# Altium schematic sheet Concept.SchDoc: MPPT Controller
size 840 x 594 mm; Date: 16/02/2020; Author: Tikhonov; DrawnBy: Tikhonov; Engineer: Tikhonov; DocumentNumber: -; Revision: A; SheetNumber: 1; SheetTotal: 1; DocumentType: Block schematic; Liter: {Liter}; PageSetup: Record=PageOptions|CenterHorizontal=True|CenterVertical=True|PrintScale=0.68|XCorrection=1.00|YCorrection=1.00|PrintKind=1|BorderSize=5000000|LeftOffset=0|BottomOffset=0|Orientation=2|PaperLength=1000|PaperWidth=1000|Scale=100|PaperSource=7|PrintQuality=-4|MediaType=1|DitherType=10|PaperKind=A3 (297 x 420 мм)|PrintScaleMode=1; DocumentStatus: Released; DecimalNumber: -; Language: en; ResponsibleDept: -; DocumentFullPathAndName: -; DocumentName: -
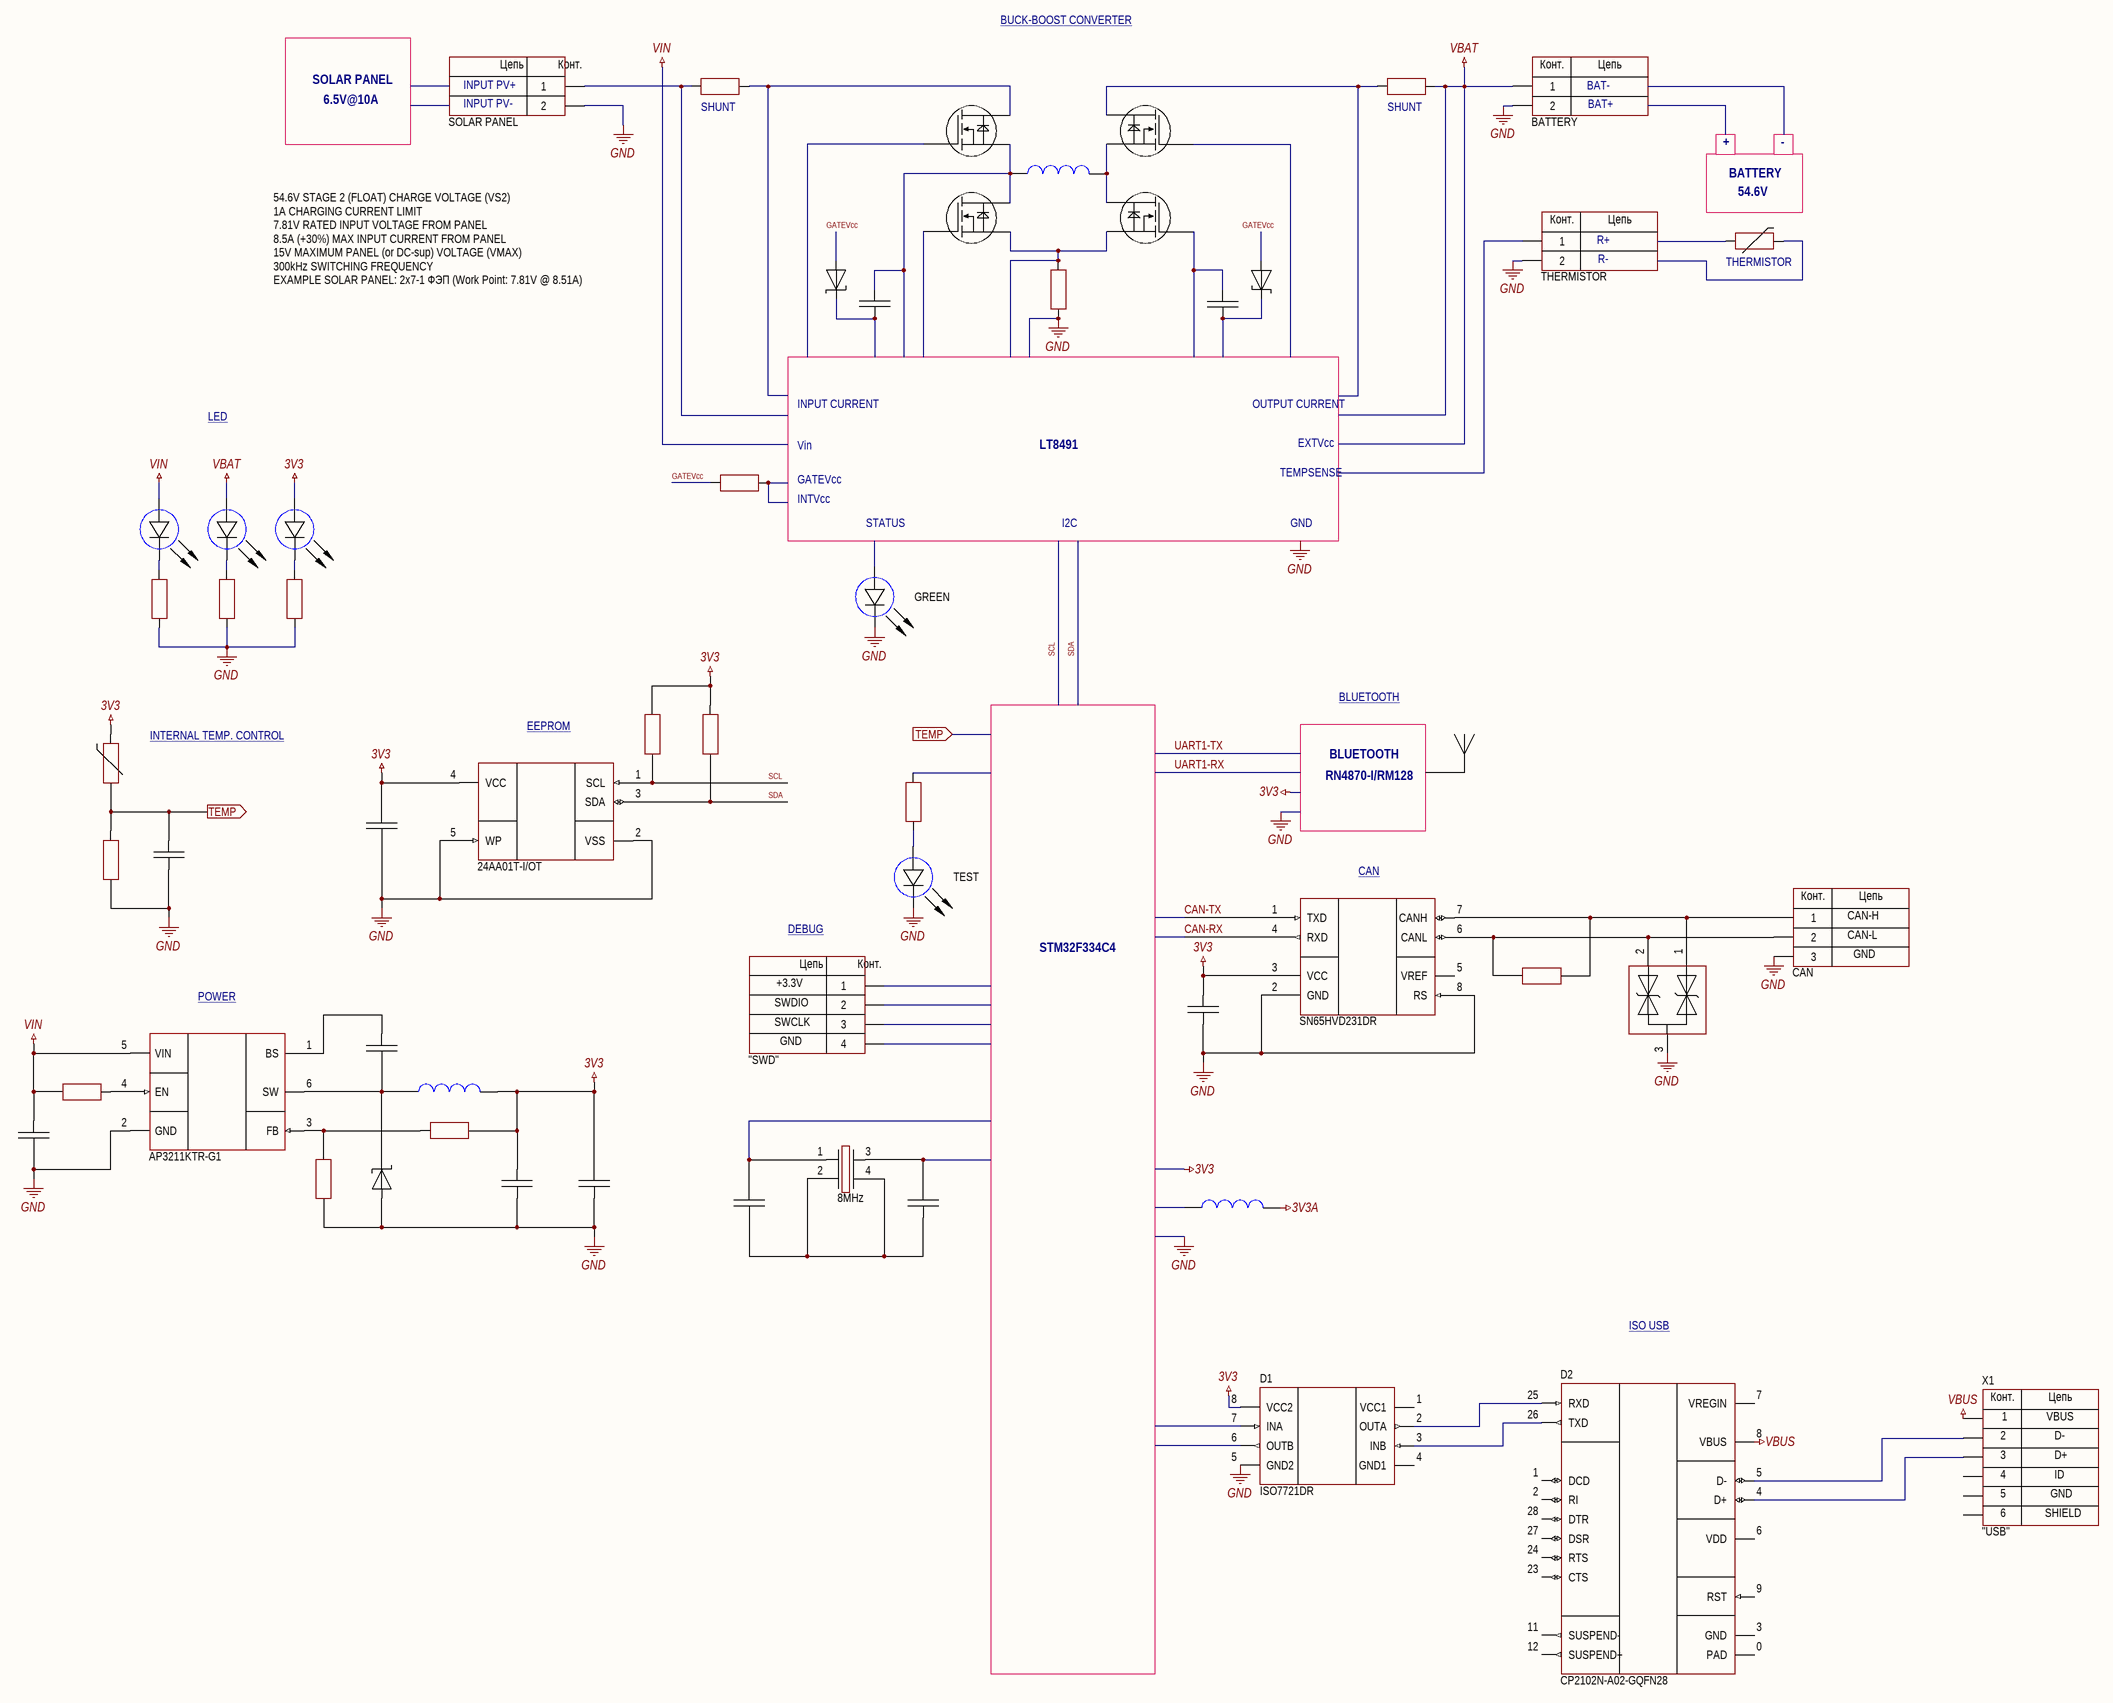
[diagram p0: Concept.SchDoc]

## Parts
(Parts that share a designator on the sheet are numbered #1, #2 ... from top to bottom, then left to right.)
C18  (no value)  [CAP: 0805]
C20  (no value)  [CAP: 0805]
C21  (no value)  [CAP: 0805]
C22  (no value)  [CAP: 0805]
C39  (no value)  [CAP: 0805]
C40  (no value)  [CAP: 0805]
C41  (no value)  [CAP: 0805]
C42  (no value)  [CAP: 0805]
C43  (no value)  [CAP: 0805]
C?#1  (no value)  [CAP: 0603]
C?#2  (no value)  [CAP: 0603]
D1  (no value)  [8-SOIC]
D2  PartNumber: CP2102N-A02-GQFN28  [28-QFN (5x5)]
D4  (no value)  [SOT23-6]
D8  PartNumber: 24AA01T-I/OT  [SOT23-5]
D9  (no value)  [8-SOIC]
L2  (no value)  [IND: SDR0403]
L?#1  (no value)  [IND: 0603]
L?#2  (no value)  [IND: 0603]
R32  (no value)  [RES: 0805]
R33  (no value)  [RES: 0805]
R36  (no value)  [RES: 0805]
R43  (no value)  [RES: 0805]
R44  (no value)  [RES: 0805]
R45  (no value)  [RES: 0805]
R48  (no value)  [RES: 0805]
R49  (no value)  [RES: 0805]
R?#1  (no value)  [RES: 0603]
R?#2  (no value)  [RES: 0603]
R?#3  TypeResistor: THERMISTOR  [RES: 0805]
R?#4  (no value)  [RES: 0603]
R?#5  (no value)  [RES: 0603]
R?#6  (no value)  [RES: 0603]
R?#7  (no value)  [RES: 0603]
R?#8  (no value)  [RES: 0603]
R?#9  (no value)  [RES: 0603]
VD3  (no value)  [DIODE: SOD123F]
VD5  (no value)  [SOT23]
VD?#1  (no value)  [DIODE: SMA]
VD?#2  (no value)  [DIODE: SMA]
VD?#3  (no value)  [LED: 0402B]
VD?#4  (no value)  [LED: 0402B]
VD?#5  (no value)  [LED: 0402B]
VD?#6  Color: GREEN  [LED: 0402B]
VD?#7  Color: TEST  [LED: 0402B]
VT?#1  MOSFET_N  (value not drawn)
VT?#2  MOSFET_N  (value not drawn)
VT?#3  MOSFET_N  (value not drawn)
VT?#4  MOSFET_N  (value not drawn)
X1  CommentText: "USB"  [CON: USB micro-A (ZX62-B-5PA)]
X2#1  CommentText: SOLAR PANEL  1: INPUT PV+  2: INPUT PV-  [CON: XT60PW-M]
X2#2  CommentText: BATTERY  1: BAT-  2: BAT+  [CON: XT60PW-M]
X2#3  CommentText: THERMISTOR  1: R+  2: R-  [CON: XT60PW-M]
X4  CommentText: "SWD"  [CON: SM04B-GHS]
X?  CommentText: CAN  [CON: 6PCV-03-006]
Z1  Frequency: 8MHz  [OSC: 3225]

## Ports
TEMP (in), TEMP (out)

## Nets
3V3: C21.2 C22.2 C41.2 C42.2 D1.8(VCC2) D8.4(VCC) D9.3(VCC) L2.1 R33.1 R43.2 R44.2 R48.2 VD?#5.1(A)
3V3A: L?#2.1
GND: C20.1 C21.1 C22.1 C41.1 C42.1 C43.1 D1.5(GND2) D4.2(GND) D8.2(VSS) D8.5(WP) D9.2(GND) D9.8(RS) R36.1 R49.1 R?#4.1 R?#6.1 R?#7.1 R?#8.1 VD3.1 VD5.3 VD?#6.2(C) VD?#7.2(C) X2#1.2 X2#2.2 X2#3.2 X?.3
VBAT: R?#2.1 VD?#4.1(A) X2#2.1
VBUS: D2.8(VBUS) X1.1
VIN: C20.2 D4.5(VIN) R32.2 VD?#3.1(A)
CAN-RX: D9.4(RXD)
CAN-TX: D9.1(TXD)
GATEVcc: R?#5.2
SCL: D8.1(SCL) R43.1
SDA: D8.3(SDA) R44.1
TEMP: C43.2 R48.1 R49.2 ; port TEMP
NetC18_1: C18.1 D4.6(SW) L2.2 VD3.2
NetC18_2: C18.2 D4.1(BS)
NetC39_1: C39.1 C40.1 Z1.2 Z1.4
NetC39_2: C39.2 Z1.1
NetC40_2: C40.2 Z1.3
NetC?#1_1: C?#1.1 VD?#1.2
NetC?#1_2: C?#1.2 L?#1.2 VT?#1.S VT?#3.D
NetC?#2_1: C?#2.1 VD?#2.2
NetC?#2_2: C?#2.2 VT?#4.G
NetD1_2: D1.2(OUTA) D2.25(RXD)
NetD1_3: D1.3(INB) D2.26(TXD)
NetD2_4: D2.4(D+) X1.3
NetD2_5: D2.5(D-) X1.2
NetD4_3: D4.3(FB) R33.2 R36.2
NetD4_4: D4.4(EN) R32.1
NetD9_6: D9.6(CANL) R45.2 VD5.2 X?.2
NetD9_7: D9.7(CANH) R45.1 VD5.1 X?.1
NetL?#1_1: L?#1.1 VT?#2.S VT?#4.D
NetR?#1_1: R?#1.1 VT?#1.D
NetR?#1_2: R?#1.2 X2#1.1
NetR?#2_2: R?#2.2 VT?#2.D
NetR?#4_2: R?#4.2 VT?#3.S VT?#4.S
NetR?#6_2: R?#6.2 VD?#3.2(C)
NetR?#7_2: R?#7.2 VD?#4.2(C)
NetR?#8_2: R?#8.2 VD?#5.2(C)
NetR?#9_1: R?#9.1 VD?#7.1(A)

Not connected (* = marked no-connect by the designer): D1 1(VCC1) 4(GND1) 6(OUTB) 7(INA); D2 0(PAD) 1(DCD) 2(RI) 3(GND) 6(VDD) 7(VREGIN) 9(RST) 11(SUSPEND-) 12(SUSPEND+) 23(CTS) 24(RTS) 27(DSR) 28(DTR); D9 5(VREF); L?#2 2; R?#3 1 2; R?#5 1; R?#9 2; VD?#1 1; VD?#2 1; VD?#6 1(A); VT?#1 G; VT?#2 G; VT?#3 G; X1 0 4 5; X2#3 1; X4 1 2 3 4

## Notes on the sheet
- BUCK-BOOST CONVERTER
- SOLAR PANEL
- 6.5V@10A
- (near R?#1) SHUNT
- (near R?#2) SHUNT
- +
- -
- BATTERY
- 54.6V
- 54.6V STAGE 2 (FLOAT) CHARGE VOLTAGE (VS2)
  1A CHARGING CURRENT LIMIT
  7.81V RATED INPUT VOLTAGE FROM PANEL
  8.5A (+30%) MAX INPUT CURRENT FROM PANEL
  15V MAXIMUM PANEL (or DC-sup) VOLTAGE (VMAX)
  300kHz SWITCHING FREQUENCY
  EXAMPLE SOLAR PANEL: 2x7-1 ФЭП (Work Point: 7.81V @ 8.51A)
- INPUT CURRENT
- OUTPUT CURRENT
- LED
- Vin
- LT8491
- EXTVcc
- (near R?#5) GATEVcc
- INTVcc
- TEMPSENSE
- STATUS
- I2C
- GND
- BLUETOOTH
- (near R48) INTERNAL TEMP. CONTROL
- EEPROM
- RN4870-I/RM128
- (near D9) CAN
- DEBUG
- STM32F334C4
- CAN-H
- CAN-L
- POWER
- SWDIO
- +3.3V
- SWCLK
- ISO USB
- Labels drawn without touching a wire or pin: GATEVcc, GND
- 1
- 2
- 3
- 4
- 5
- 6
- 7
- 8
- 9
- 10
- 11
- 12
- 13
- 14
- 15
- 16
- A
- B
- C
- D
- E
- F
- G
- H
- K
- L
- M
- Responsible dept.
- Technical reference
- Document type
- Document status
- N
- Legal owner
- Created by
- Title, Supplementary title
- Approved by
- Rev.
- Date of issue
- Lang.
- Sheet
- /
- A1
- (in symbol Connector_6PCV-03) Конт.; Цепь
- (in symbol Connector_SM04B) Цепь; Конт.
- (in symbol Connector_USB_micro_B) Конт.; Цепь; VBUS; D-; D+; ID; GND; 6; SHIELD
- (in symbol Connector_XT_2pin) Цепь; Конт.

## Library data of the parts
C18 C43 = Ceramic_0805: Manufacturer: Samsung; PartNumber: CL21B103KBANNNC; TypeCapacitor: Ceramic capacitor; TypeDielectric: X7R; Package: 0805; HelpURL: https://www.digikey.com/product-detail/en/samsung-electro-mechanics/CL21B103KBANNNC/1276-1015-1-ND/3889101; ValueManufacturerPartNumber: =TypeCapacitor+', '+Value+', '+TypeDielectric+', '+Tolerance+', '+Voltage+', '+Package+', '+Temperature; Temperature: -55...+125°C
C20 = Ceramic_0805: Manufacturer: Samsung; PartNumber: CL21B225KAFNFNE; TypeCapacitor: Ceramic capacitor; TypeDielectric: X7R; Package: 0805; HelpURL: https://www.digikey.com/product-detail/en/samsung-electro-mechanics/CL21B225KAFNFNE/1276-2953-1-ND/3891039; ValueManufacturerPartNumber: =TypeCapacitor+', '+Value+', '+TypeDielectric+', '+Tolerance+', '+Voltage+', '+Package+', '+Temperature; Temperature: -55...+125°C
C21 C22 = Ceramic_0805: Manufacturer: Samsung; PartNumber: CL21B106KQQNNNG; TypeCapacitor: Ceramic capacitor; TypeDielectric: X7R; Package: 0805; HelpURL: https://www.digikey.com/product-detail/en/samsung-electro-mechanics/CL21B106KQQNNNG/1276-6474-1-ND/5958102; ValueManufacturerPartNumber: =TypeCapacitor+', '+Value+', '+TypeDielectric+', '+Tolerance+', '+Voltage+', '+Package+', '+Temperature; Temperature: -55...+125°C
C39 C40 = Ceramic_0805: Manufacturer: Samsung; PartNumber: CL21C120JBANNNC; TypeCapacitor: Ceramic capacitor; TypeDielectric: NPO; Package: 0805; HelpURL: https://www.digikey.com/product-detail/en/samsung-electro-mechanics/CL21C120JBANNNC/1276-1120-1-ND/3889206; ValueManufacturerPartNumber: =TypeCapacitor+', '+Value+', '+TypeDielectric+', '+Tolerance+', '+Voltage+', '+Package+', '+Temperature; Temperature: -55...+125°C
C41 C42 = Ceramic_0805: Manufacturer: Samsung; PartNumber: CL21B104KBCNFNC; TypeCapacitor: Ceramic capacitor; TypeDielectric: X7R; Package: 0805; HelpURL: https://www.digikey.com/product-detail/en/samsung-electro-mechanics/CL21B104KBCNFNC/1276-2444-1-ND/3890530; ValueManufacturerPartNumber: =TypeCapacitor+', '+Value+', '+TypeDielectric+', '+Tolerance+', '+Voltage+', '+Package+', '+Temperature; Temperature: -55...+125°C
C?#1 C?#2 = Ceramic_0603: Manufacturer: Yageo; PartNumber: CC0603KRX7R7BB104; ValueManufacturerPartNumber: Ceramic capacitor, 0.1?F, X7R, ±10%, 16V, 0603, -55...+125°C; TypeCapacitor: Ceramic capacitor; Tolerance: ±10%; TypeDielectric: X7R; Voltage: 16V; Value: 0.1?F; Package: 0603; HelpURL: https://www.digikey.com/product-detail/en/yageo/CC0603KRX7R7BB104/311-1088-1-ND/302998; Temperature: -55...+125°C
D1 = ISO7721DR: Digital isolator; Manufacturer: Texas Instruments; ValueManufacturerPartNumber: IC digital isolator, 100Mbps, 3000Vrms, 2.25...5.5V, -55...+125°C, 8-SOIC; Supply: 2.25...5.5V; DataRate: 100Mbps; Isolation: 3000Vrms; HelpURL: https://www.digikey.com/product-detail/en/texas-instruments/ISO7721DR/296-48296-1-ND/8347715; Package: 8-SOIC; ComponentType: IC digital isolator; Temperature: -55...+125°C; PartNumber: ISO7721DR
D2 = CP2102N: USB-to-UART; Manufacturer: Silicon Labs; ValueManufacturerPartNumber: IC usb-to-uart bridge, USB2.0, 3...3.6V, -40...+85°C, 28-VFQFN; Supply: 3...3.6V; HelpURL: https://www.digikey.com/product-detail/en/silicon-labs/CP2102N-A02-GQFN28/336-5889-ND/9863477; Package: 28-VFQFN; ComponentType: IC usb-to-uart bridge; Temperature: -40...+85°C; Standard: USB2.0
D4 = AP3211KTR-G1: Buck converter; Manufacturer: Diodes Incorporated; ValueManufacturerPartNumber: DC/DC buck converter, input 4.5...18V, 1.4MHz, output 0.81...15V, 1.5A, -40...+85°C, SOT23-6; VoltageInput: input 4.5...18V; Frequency: 1.4MHz; CurrentOutput: 1.5A; VoltageOutput: output 0.81...15V; HelpURL: https://www.digikey.com/product-detail/en/diodes-incorporated/AP3211KTR-G1/AP3211KTR-G1DICT-ND/4505305; Package: SOT23-6; ComponentType: DC/DC buck converter; Temperature: -40...+85°C; PartNumber: AP3211KTR-G1
D8 = 24AA01T: EEPROM; Manufacturer: Microchip Technology; ValueManufacturerPartNumber: IC memory, EEPROM, 1KB (128x8), 400 kHz, I2C, 1.7...5.5V, -40...+85°C, SOT-23-5; Supply: 1.7...5.5V; Speed: 400 kHz; InterfaceData: I2C; MemorySize: 1KB (128x8); HelpURL: https://www.digikey.com/product-detail/en/microchip-technology/24AA01T-I-OT/24AA01T-I-OTCT-ND/857670; Package: SOT-23-5; ComponentType: IC memory; Temperature: -40...+85°C; MemoryType: EEPROM
D9 = SN65HVD231DR: CAN; Manufacturer: Texas Instruments; ValueManufacturerPartNumber: IC CAN transceiver, 1Mbps, Half-duplex, 3...3.6V, -40...+85°C, 8-SOIC; Supply: 3...3.6V; DataRate: 1Mbps; TypeDuplex: Half-duplex; HelpURL: https://www.digikey.com/product-detail/en/texas-instruments/SN65HVD231DR/296-26343-1-ND/2254977; Package: 8-SOIC; ComponentType: IC CAN transceiver; Temperature: -40...+85°C; PartNumber: SN65HVD231DR
L2 = Inductor_SDR0403: Manufacturer: Bourns; PartNumber: SDR0403-4R7ML; ValueManufacturerPartNumber: Fixed inductor, 4.7?H, ±20%, SDR0403, 1.7A, -40...+125°C; TypeInductor: Fixed inductor; MaxCurrent: 1.7A; Tolerance: ±20%; Value: 4.7?H; Package: SDR0403; HelpURL: https://www.digikey.com/product-detail/en/bourns-inc/SDR0403-4R7ML/SDR0403-4R7MLCT-ND/2127096; Temperature: -40...+125°C
L?#1 L?#2 = Inductor_0603: Manufacturer: Murata Electronics; PartNumber: LQM18FN100M00D; ValueManufacturerPartNumber: Fixed inductor, 10?H, ±20%, 0603, 50mA, -55...+125°C; TypeInductor: Fixed inductor; MaxCurrent: 50mA; Tolerance: ±20%; Value: 10?H; Package: 0603; HelpURL: https://www.digikey.com/product-detail/en/murata-electronics-north-america/LQM18FN100M00D/490-4025-1-ND/1016285; Temperature: -55...+125°C
R32 = Resistor_0805: Manufacturer: Yageo; PartNumber: RC0805JR-0710KL; TypeResistor: Resistor film; Power: 0.125W; Package: 0805; HelpURL: https://www.digikey.com/product-detail/en/yageo/RC0805JR-0710KL/311-10KARCT-ND/731188; ValueManufacturerPartNumber: =TypeResistor+', '+Value+', '+Tolerance+', '+Package+', '+Power+', '+Temperature; Temperature: -55...+125°C
R33 = Resistor_0805: Manufacturer: Yageo; PartNumber: RC0805FR-0730K9L; TypeResistor: Resistor film; Power: 0.125W; Package: 0805; HelpURL: https://www.digikey.com/product-detail/en/yageo/RC0805FR-0730K9L/311-30.9KCRCT-ND/730794; ValueManufacturerPartNumber: =TypeResistor+', '+Value+', '+Tolerance+', '+Package+', '+Power+', '+Temperature; Temperature: -55...+125°C
R36 = Resistor_0805: Manufacturer: Yageo; PartNumber: RC0805FR-0710KL; TypeResistor: Resistor film; Power: 0.125W; Package: 0805; HelpURL: https://www.digikey.com/product-detail/en/yageo/RC0805FR-0710KL/311-10.0KCRCT-ND/730482; ValueManufacturerPartNumber: =TypeResistor+', '+Value+', '+Tolerance+', '+Package+', '+Power+', '+Temperature; Temperature: -55...+125°C
R43 R44 = Resistor_0805: Manufacturer: Yageo; PartNumber: RC0805JR-072K2L; TypeResistor: Resistor film; Power: 0.125W; Package: 0805; HelpURL: https://www.digikey.com/product-detail/en/yageo/RC0805JR-072K2L/311-2.2KARCT-ND/731218; ValueManufacturerPartNumber: =TypeResistor+', '+Value+', '+Tolerance+', '+Package+', '+Power+', '+Temperature; Temperature: -55...+125°C
R45 = Resistor_0805: Manufacturer: Yageo; PartNumber: RC0805JR-07120RL; TypeResistor: Resistor film; Power: 0.125W; Package: 0805; HelpURL: https://www.digikey.com/product-detail/en/yageo/RC0805JR-07120RL/311-120ARCT-ND/731194; ValueManufacturerPartNumber: =TypeResistor+', '+Value+', '+Tolerance+', '+Package+', '+Power+', '+Temperature; Temperature: -55...+125°C
R48 = NTC: Manufacturer: TDK; PartNumber: B57401V2472J062; TypeResistor: NTC resistor; MaxCurrent: 3650K; Package: 0805; HelpURL: https://www.digikey.com/product-detail/en/tdk-electronics-inc/B57401V2472J062/495-7444-1-ND/6073136; ValueManufacturerPartNumber: =TypeResistor+', '+Value+', '+Tolerance+', '+Package+', '+MaxCurrent+', '+Temperature; Temperature: -55...+125°C
R49 = Resistor_0805: Manufacturer: Yageo; PartNumber: RC0805FR-075K1L; TypeResistor: Resistor film; Power: 0.125W; Package: 0805; HelpURL: https://www.digikey.com/product-detail/en/yageo/RC0805FR-075K1L/311-5.10KCRCT-ND/730935; ValueManufacturerPartNumber: =TypeResistor+', '+Value+', '+Tolerance+', '+Package+', '+Power+', '+Temperature; Temperature: -55...+125°C
R?#1 R?#2 R?#4-R?#9 = Resistor_0603: Manufacturer: Yageo; PartNumber: RC0603JR-07100RL; ValueManufacturerPartNumber: Resistor film, 100R, ±5%, 0603, 0.1W, -55...+125°C; TypeResistor: Resistor film; Power: 0.1W; Tolerance: ±5%; Value: 100R; Package: 0603; HelpURL: https://www.digikey.com/product-detail/en/yageo/RC0603JR-07100RL/311-100GRCT-ND/729644; Temperature: -55...+125°C
R?#3 = NTC: Manufacturer: Epcos; PartNumber: B57237S229M54; ValueManufacturerPartNumber: THERMISTOR, 2R2, ±20%, pitch 7.5mm, 7A, -55...+125°C; MaxCurrent: 7A; Tolerance: ±20%; Value: 2R2; Package: pitch 7.5mm; HelpURL: https://www.digikey.com/product-detail/en/epcos-tdk/B57237S229M54/495-76635-1-ND/8126375; Temperature: -55...+125°C
VD3 = Schottky_single: Manufacturer: ON Semiconductor; ValueManufacturerPartNumber: Schottky diode, 100V, 2A, 840mV, 15pF, SOD-123F, -55...+150°C; PartNumber: MBR2H100SFT3G; TypeDiode: Schottky diode; Voltage: 100V; Current: 2A; VoltageDrop: 840mV; RecoveryTime: 15pF; Package: SOD-123F; HelpURL: https://www.digikey.com/product-detail/en/on-semiconductor/MBR2H100SFT3G/MBR2H100SFT3GOSCT-ND/3462288; Temperature: -55...+150°C
VD5 = TVS_array: Manufacturer: STMicroelectronics; ValueManufacturerPartNumber: TVS diode, 24V, 230W peak, 3A, 13pF, SOT-23, -40...+150°C; PartNumber: ESDCAN06-2BLY; TypeDiode: TVS diode; Current: 230W peak; VoltageDrop: 3A; RecoveryTime: 13pF; Voltage: 24V; Package: SOT-23; HelpURL: https://www.digikey.com/product-detail/en/stmicroelectronics/ESDCAN06-2BLY/497-19090-1-ND/10057130; Temperature: -40...+150°C
VD?#1 VD?#2 = Schottky_single: Manufacturer: Diodes Incorporated; ValueManufacturerPartNumber: Schottky diode, 80V, 500mA, 1V, 15pF, SOD-123, -55...+150°C; PartNumber: MBR0580S1-7; TypeDiode: Schottky diode; Voltage: 80V; Current: 500mA; VoltageDrop: 1V; RecoveryTime: 15pF; Package: SOD-123; HelpURL: https://www.digikey.com/product-detail/en/diodes-incorporated/MBR0580S1-7/MBR0580S1-7DICT-ND/5080371; Temperature: -55...+150°C
VD?#3-VD?#5 = LED_single: ValueManufacturerPartNumber: LED, *, *, *, -55...+150°C; TypeDiode: LED; Color: GREEN; Manufacturer: *; Package: *; HelpURL: *; Temperature: -55...+150°C; Current: *; VoltageDrop: *; PartNumber: *
VD?#6 VD?#7 = LED_single: ValueManufacturerPartNumber: LED, *, *, *, -55...+150°C; TypeDiode: LED; Manufacturer: *; Package: *; HelpURL: *; Temperature: -55...+150°C; Current: *; VoltageDrop: *; PartNumber: *
VT?#1-VT?#4 = MOSFET_N: Транзистор; Manufacturer: Infineon; Part Number: IRLML2502TRPbF; Pattern footprint: SOT-23-3; HelpURL: https://www.mouser.com/datasheet/2/196/irlml2502pbf-1228585.pdf; Published: 07.11.2018; Publisher: Воробьев; RefDes/Designator: *; Tolerance: *; Value: *
X1 = Connector_USB_micro_B: Manufacturer: Hirose Electric; ValueManufacturerPartNumber: USB micro B; PartNumber: ZX62-B-5PA; HelpURL: https://www.digikey.com/product-detail/en/hirose-electric-co-ltd/ZX62-B-5PA/H11579CT-ND/1851090; TypeConnector: USB micro B
X2#1-X2#3 = Connector_XT_2pin: Manufacturer: AMASS; ValueManufacturerPartNumber: Power connector, 2pin, 7.2mm, 500V, 60A; PartNumber: XT60PW-M; TypeConnector: Power connector; VoltageMax: 500V; Pitch: 7.2mm; CurrentMax: 60A; Multichannel: 2pin; HelpURL: https://lcsc.com/product-detail/Connectors_Changzhou-Amass-Elec-XT60PW-M_C98732.html
X4 = Connector_SM04B: Manufacturer: JST; ValueManufacturerPartNumber: Connector, 4pin, 1.25mm, 50VDC, 1A; PartNumber: SM04B-GHS; VoltageMax: 50VDC; Pitch: 1.25mm; CurrentMax: 1A; Multichannel: 4pin; HelpURL: https://www.digikey.com/product-detail/en/jst-sales-america-inc/SM04B-GHS-TB-LF-SN/455-1566-1-ND/807834; TypeConnector: Connector
X? = Connector_6PCV-03: Manufacturer: TE Connectivity; ValueManufacturerPartNumber: Connector, 3pin, 9.53mm, 300VAC, 25A; PartNumber: 6PCV-03-006; VoltageMax: 300VAC; Pitch: 9.53mm; CurrentMax: 25A; Multichannel: 3pin; HelpURL: https://www.digikey.com/products/en?keywords=6PCV-03-006; TypeConnector: Connector
Z1 = Crystal_3225: Manufacturer: ECS; PartNumber: ECS-80-12-33-JGN-TR; ValueManufacturerPartNumber: Crystal, 8MHz, 12pF, ±30ppm, case 3225, -40...+85°C; LoadCapacitance: 12pF; Tolerance: ±30ppm; Package: case 3225; HelpURL: https://www.digikey.com/product-detail/en/ecs-inc/ECS-80-12-33-JGN-TR/50-ECS-80-12-33-JGN-CT-ND/10478769; Temperature: -40...+85°C; TypeOscilator: Crystal